# Altium schematic sheet 03. EXCUTE BLOCK.SchDoc
size A2
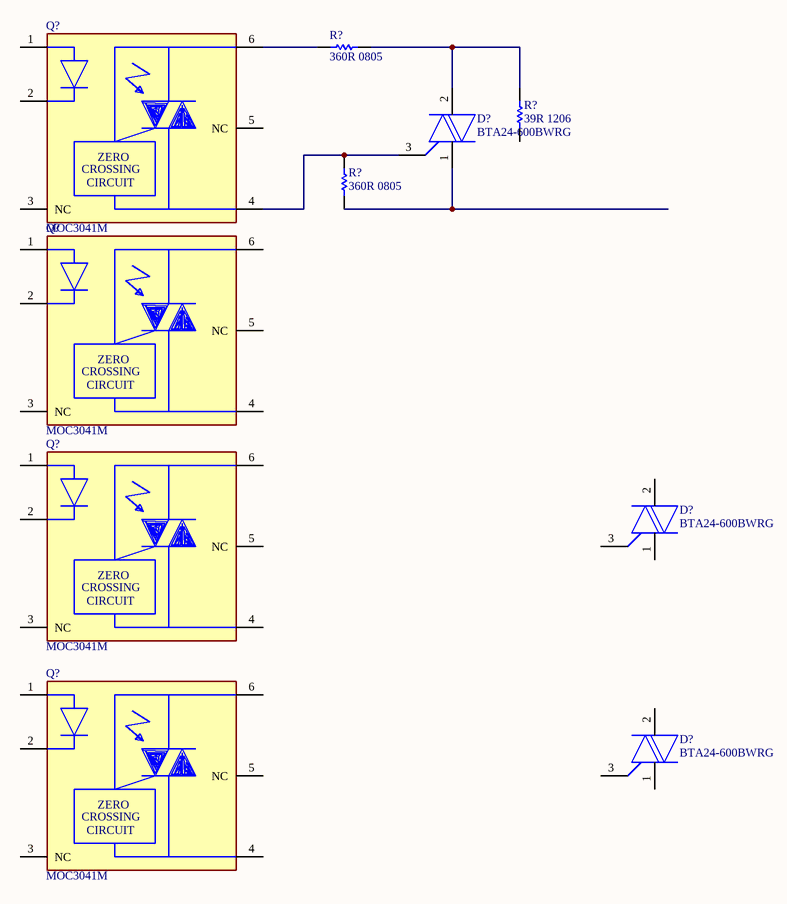
[diagram p0: 03. EXCUTE BLOCK.SchDoc]

## Parts
(Parts that share a designator on the sheet are numbered #1, #2 ... from top to bottom, then left to right.)
D?#1  BTA24-600BWRG  [FP-TO-220AB-MFG]
D?#2  BTA24-600BWRG  [FP-TO-220AB-MFG]
D?#3  BTA24-600BWRG  [FP-TO-220AB-MFG]
Q?#1  MOC3041M  [FP-646BX-MFG]
Q?#2  MOC3041M  [FP-646BX-MFG]
Q?#3  MOC3041M  [FP-646BX-MFG]
Q?#4  MOC3041M  [FP-646BX-MFG]
R?#1  360R 0805  [RESC2013X50X30ML20T20]
R?#2  39R 1206  [RESC3216X60X45ML10T20]
R?#3  360R 0805  [RESC2013X50X30ML20T20]

## Nets
NetD?#1_1: D?#1.1(A1) R?#3.1
NetD?#1_2: D?#1.2(A2) R?#1.2 R?#2.2
NetD?#1_3: D?#1.3(G) Q?#1.4(1_MAIN_TERM.) R?#3.2
NetQ?#1_6: Q?#1.6(2_MAIN_TERM.) R?#1.1

Not connected (* = marked no-connect by the designer): D?#2 1(A1) 2(A2) 3(G); D?#3 1(A1) 2(A2) 3(G); Q?#1 1(A) 2(C) 3(NC) 5(NC); Q?#2 1(A) 2(C) 3(NC) 4(1_MAIN_TERM.) 5(NC) 6(2_MAIN_TERM.); Q?#3 1(A) 2(C) 3(NC) 4(1_MAIN_TERM.) 5(NC) 6(2_MAIN_TERM.); Q?#4 1(A) 2(C) 3(NC) 4(1_MAIN_TERM.) 5(NC) 6(2_MAIN_TERM.); R?#2 1

## Notes on the sheet
- Title
- Size:
- Date:
- Design by:
- A4
- Number:
- Time:
- Check by:
- Revision:
- Sheet
- of
- N.S.T
- https://github.com/tung080827
- (in symbol CMP-07144-000005-1) ZERO; CROSSING; CIRCUIT

## Library data of the parts
D?#1-D?#3 = CMP-12193-000008-1: TRIAC ALTERNISTOR 600V TO220AB; Manufacturer: STMicroelectronics; On State Current Rms: 25A; Max Junction Temp: +125°C; Hold Current: 75mA; Gate Trigger Voltage: 1.3V; Description: TRIAC Alternistor - Snubberless 600V 25A Through Hole TO-220AB; Gate Trigger Current: 50mA; Standoff Height: 3.75mm; Forward Voltage: 1.55V; Off State Voltage: 600V; Category: Diode; Temperature Range Low: -40°C; ComponentLink2URL: https://www.st.com/resource/en/datasheet/bta24.pdf; Temperature: -40°C to +125°C; ComponentLink2Description: Datasheet; Automotive: No; Lead Free: Yes; Mouser Description: Triacs 25 Amp 600 Volt; Temperature Range High: +125°C; Manufacturer Part Number: BTA24-600BWRG; Digikey Description: TRIAC ALTERNISTOR 600V TO220AB; Octopart: https://octopart.com/bta24-600bwrg-stmicroelectronics-360258; RoHS: TRUE; Device Class L2: Thyristors; Height: 19.65mm; Device Class L1: Discrete Semiconductors; Device Class L3: TRIACs; Package: TO-220AB
Q?#1-Q?#4 = CMP-07144-000005-1: OPTOISOLATOR 4.17KV TRIAC 6DIP; Manufacturer: ON Semiconductor; Forward Voltage: 1.25V; Power Dissipation: 250mW; Forward Current: 30mA; Reverse Voltage: 6V; Description: Optoisolator Triac Output 4170Vrms 1 Channel 6-DIP; Max Junction Temp: +100°C; Isolation Voltage: 4170Vrms; Standoff Height: 0.38mm; Octopart: https://octopart.com/moc3041m-on+semiconductor-84330395; Temperature Range Low: -40°C; Category: Trans; Package: 646BX; Height: 5.08mm; Manufacturer Part Number: MOC3041M; ComponentLink2Description: Datasheet; Device Class L2: Optocouplers; Device Class L1: Optoelectronics; Device Class L3: unset; Automotive: No; RoHS: TRUE; Mouser Description: Optocoupler Triac AC Output 1 Channel 400VDRM 6-Pin Plastic Dip White Bulk; Temperature: -40°C to +85°C; Lead Free: Yes; ComponentLink2URL: https://www.onsemi.com/pub/Collateral/MOC3043M-D.pdf; Digikey Description: OPTOISOLATOR 4.17KV TRIAC 6DIP; Temperature Range High: +85°C; Footprint Url: https://www.onsemi.com/pub/Collateral/646BX.PDF
R?#1 R?#3 = CMP-2001-03844-1: Manufacturer: Vishay Dale; Part Number: CRCW0805360RJNEA
R?#2 = CMP-2003-02141-1: Manufacturer: Vishay Dale; Part Number: CRCW120639R0FKEA